# EAGLE design SunnyBuddy (EAGLE 6.6.0)
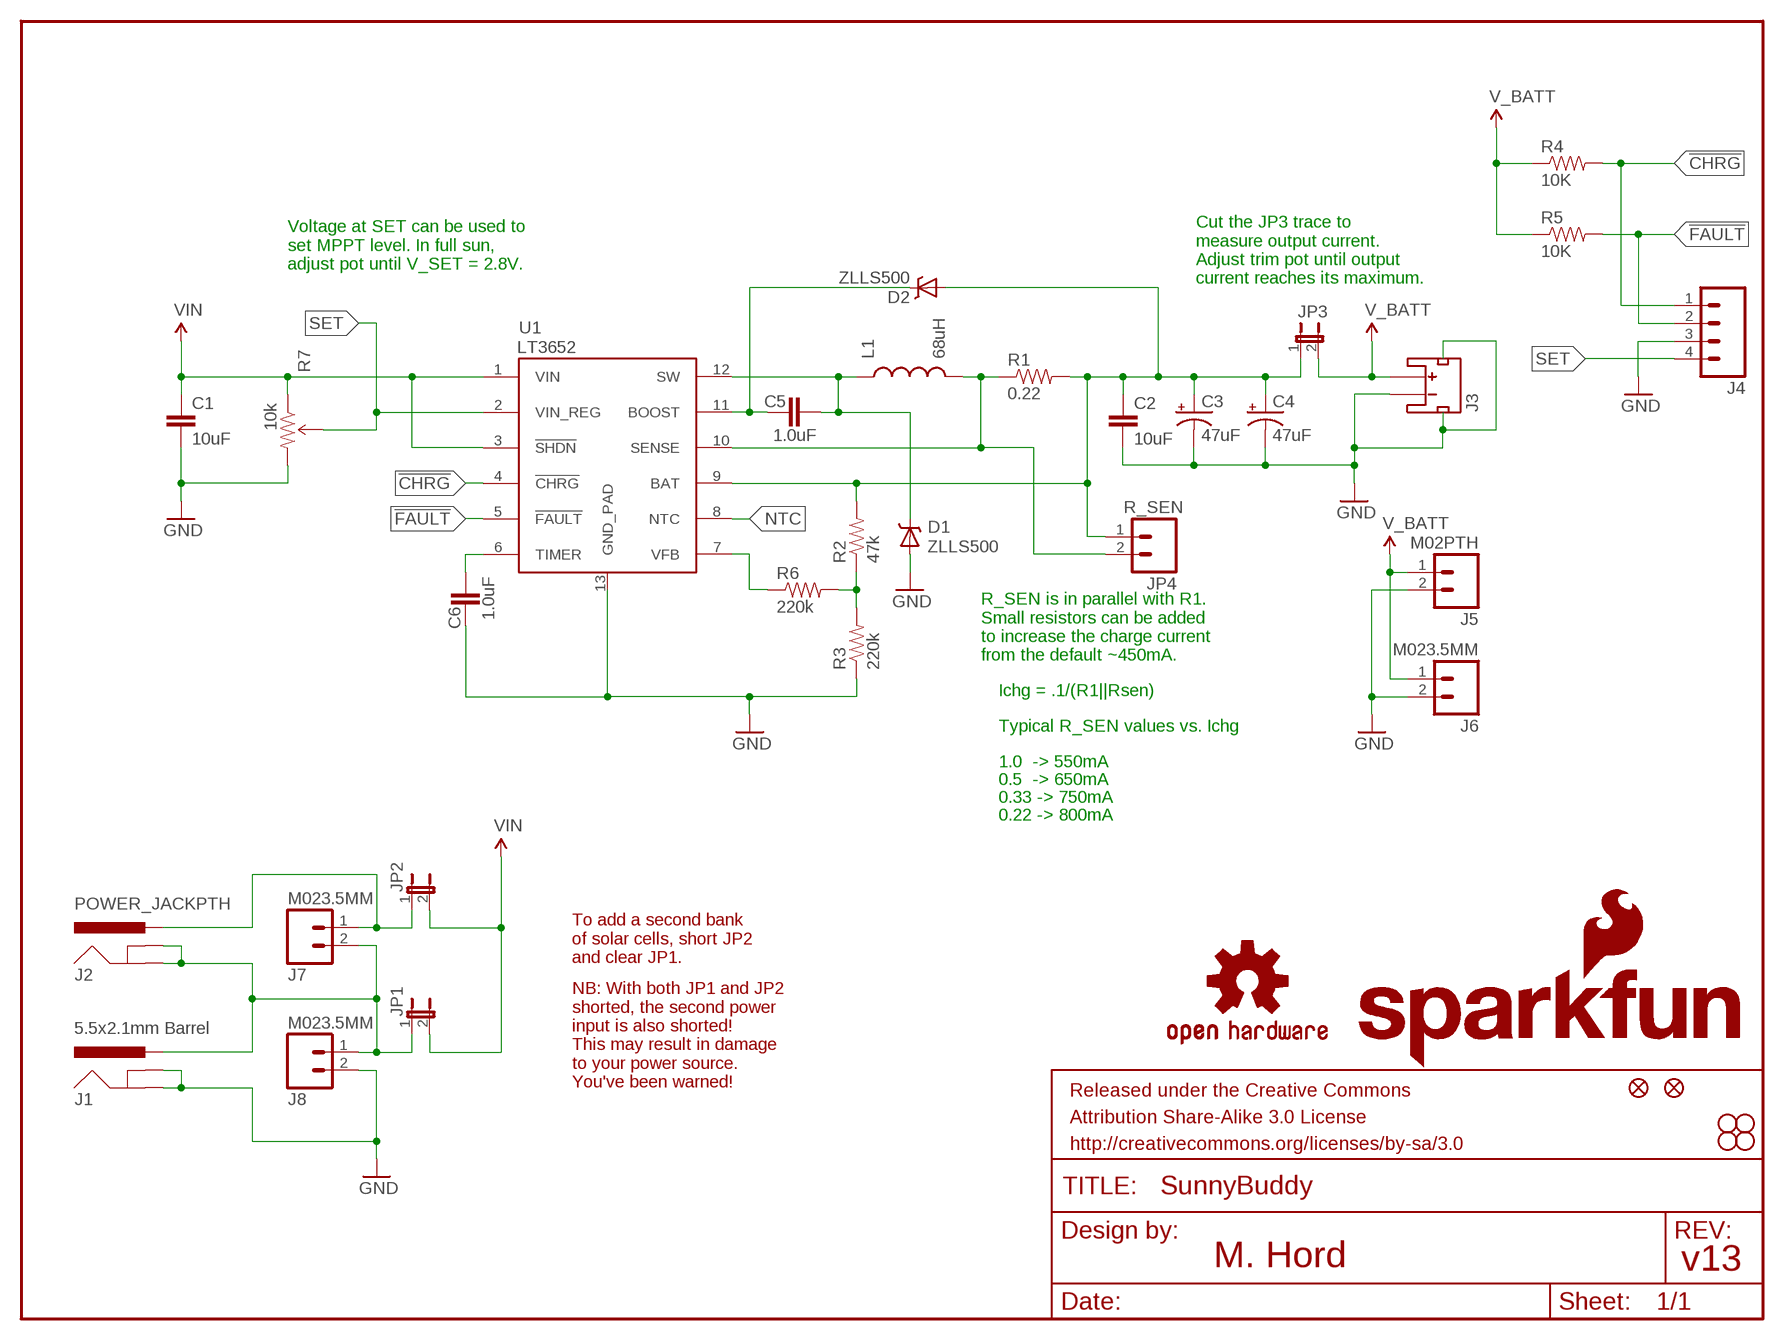
[diagram p0: schematic, sheet 1]

## Parts
C1  10uF  10UF50V20%(1210)  [1210]
C2  10uF  10UF-6.3V-20%(1206)  [1206]
C3  47uF  47UF-TANT  [EIA3528]
C4  47uF  47UF-TANT  [EIA3528]
C5  1.0uF  1.0UF-16V-10%(0603)  [0603-CAP]
C6  1.0uF  1.0UF-16V-10%(0603)  [0603-CAP]
D1  ZLLS500  ZLLS500ZLLS500  [SOT23]
D2  ZLLS500  ZLLS500ZLLS500  [SOT23]
FID1  FIDUCIAL1X2  [FIDUCIAL-1X2]
FID2  FIDUCIAL1X2  [FIDUCIAL-1X2]
FRAME1  FRAME-LETTER  [CREATIVE_COMMONS]
J1  5.5x2.1mm Barrel  POWER_JACKSMD  [POWER_JACK_SMD]
J2  POWER_JACKPTH  [POWER_JACK_PTH]
J3  JST_2MM_MALE  [JST-2-SMD]
J4  M04PTH  [1X04]
J5  M02PTH  [1X02]
J6  M023.5MM  [SCREWTERMINAL-3.5MM-2]
J7  M023.5MM  [SCREWTERMINAL-3.5MM-2]
J8  M023.5MM  [SCREWTERMINAL-3.5MM-2]
JP1  JUMPER-2SMD-NC  [SJ_2S]
JP2  JUMPER-2SMD-NO  [SJ_2S-NO]
JP3  JUMPER-PTH-2-NC  [PTH-JUMPER-NC_BOTTOM_NO_SILK]
JP4  R_SEN  M02PTH  [1X02]
L1  68uH  INDUCTOR68UH-1A  [CR75]
LOGO1  SFE_LOGO_NAME_FLAME.2_INCH  [SFE_LOGO_NAME_FLAME_.2]
LOGO2  OSHW-LOGOM  [OSHW-LOGO-M]
LOGO3  OSHW-LOGOS  [OSHW-LOGO-S]
LOGO4  SFE_LOGO_NAME_FLAME.3_INCH  [SFE_LOGO_NAME_FLAME_.3]
R1  0.22  0.22OHM1/4W1%(0805)  [0805]
R2  47k  47KOHM1/10W1%(0603)  [0603-RES]
R3  220k  220KOHM1/10W1%(0603)  [0603-RES]
R4  10K  10KOHM1/10W1%(0603)0603  [0603-RES]
R5  10K  10KOHM1/10W1%(0603)0603  [0603-RES]
R6  220k  220KOHM1/10W1%(0603)  [0603-RES]
R7  10k  TRIMPOTRES-09285  [TRIMPOT-3MM]
STANDOFF1  STAND-OFF  [STAND-OFF]
STANDOFF2  STAND-OFF  [STAND-OFF]
STANDOFF3  STAND-OFF  [STAND-OFF]
STANDOFF4  STAND-OFF  [STAND-OFF]
U1  LT3652  [MSOP-12_GND]

## Nets
!CHRG: J4.1 R4.2 U1.4(!CHRG)
!FAULT: J4.2 R5.2 U1.5(!FAULT)
BOOST: C5.1 D2.3(C) U1.11(BOOST)
FB: R2.1 R3.2 R6.2
GND: C1.2 C2.2 C3.C(-) C4.C(-) C6.1 D1.1(A) J1.GND(GNDBREAK) J1.P$4(GND) J3.1(-) J3.NC1(PAD1) J3.NC2(PAD2) J4.3 J5.2 J6.2 J8.2 R3.1 R7.3(CW) U1.13(GND_PAD)
N$3: R6.1 U1.7(VFB)
N$4: C2.1 C3.A(+) C4.A(+) D2.1(A) JP3.1 JP4.1 R1.2 R2.2 U1.9(BAT)
N$8: J1.VIN0(PWR) J2.GND J2.GNDBREAK J7.2 J8.1 JP1.1
NTC: U1.8(NTC)
SENSE: JP4.2 L1.P$2 R1.1 U1.10(SENSE)
SET: J4.4 R7.2(WIPER) U1.2(VIN_REG)
SFSASDF: J2.PWR J7.1 JP2.1
SW: C5.2 D1.3(C) L1.P$1 U1.12(SW)
TIMER: C6.2 U1.6(TIMER)
V_BATT: J3.2(+) J5.1 J6.1 JP3.2 R4.1 R5.1
VIN: C1.1 JP1.2 JP2.2 R7.1(CCW) U1.1(VIN) U1.3(!SHDN)

## Notes on the sheet
- Voltage at SET can be used to
  set MPPT level. In full sun,
  adjust pot until V_SET = 2.8V.
- Cut the JP3 trace to
  measure output current.
  Adjust trim pot until output
  current reaches its maximum.
- R_SEN is in parallel with R1.
  Small resistors can be added
  to increase the charge current
  from the default ~450mA.
- Ichg = .1/(R1||Rsen)
- Typical R_SEN values vs. Ichg
- 1.0  -> 550mA
- 0.5  -> 650mA
- 0.33 -> 750mA
- 0.22 -> 800mA
- To add a second bank
  of solar cells, short JP2
  and clear JP1.
- NB: With both JP1 and JP2
  shorted, the second power
  input is also shorted! 
  This may result in damage
  to your power source.
  You've been warned!
- M. Hord | v13

## Library data of the parts
C1 = SparkFun-Capacitors:10UF50V20%(1210): CAP-09824; PROD_ID: CAP-09824
C2 = SparkFun-Capacitors:10UF-6.3V-20%(1206): Ceramic CAP-10057; PROD_ID: CAP-10057
C3 C4 = SparkFun-Capacitors:47UF-TANT: 47uF Tantalum SMT CAP-08310- 10V 10% (EIA-3528); PROD_ID: CAP-08310
C5 C6 = SparkFun-Capacitors:1.0UF-16V-10%(0603): CAP-00868; PROD_ID: CAP-00868
D1 D2 = SparkFun-DiscreteSemi:ZLLS500: 700mA 40V SOT-23 Schottky; PROD_ID: DIO-08411
FID1 FID2 = SparkFun-Aesthetics:FIDUCIAL: Fiducial Alignment Points Various fiducial points for machine vision alignment.
FRAME1 = SparkFun-Aesthetics:FRAME-LETTER: Schematic Frame Standard 8.5x11 US Letter frame
J1 = SparkFun-Connectors:POWER_JACK: Power Jack This is the standard 5.5mm barrel jack for power. The PTH is the most common, proven, reliable, footprint. The Slot footprint only works if the mill layer is transmitted to the PCB fab house so be warned. Spark Fun Electronics SKU : PRT-00119 SMT: CONN-08106 Mating wall wart : TOL-00298 (and others); PROD_ID: CONN-08106
J2 = SparkFun-Connectors:POWER_JACK: Power Jack This is the standard 5.5mm barrel jack for power. The PTH is the most common, proven, reliable, footprint. The Slot footprint only works if the mill layer is transmitted to the PCB fab house so be warned. Spark Fun Electronics SKU : PRT-00119 SMT: CONN-08106 Mating wall wart : TOL-00298 (and others)
J3 = SparkFun-Connectors:JST_2MM_MALE: Mates to single-cell LiPo batteries. CONN-08352; PROD_ID: CONN-08352
J4 = SparkFun-Connectors:M04: Header 4 Standard 4-pin 0.1" header. Use with straight break away headers (SKU : PRT-00116), right angle break away headers (PRT-00553), swiss pins (PRT-00743), machine pins (PRT-00117), and female headers (PRT-00115). Molex polarized connector foot print use with SKU : PRT-08231 with associated crimp pins and housings. 1MM SMD Version SKU: PRT-10208
J5-J8 JP4 = SparkFun-Connectors:M02: Standard 2-pin 0.1" header. Use with - straight break away headers ( PRT-00116) - right angle break away headers (PRT-00553) - swiss pins (PRT-00743) - machine pins (PRT-00117) - female headers (PRT-00115) Molex polarized connector foot print use with: PRT-08233 with associated crimp pins and housings. 2.54_SCREWTERM for use with PRT-10571. 3.5mm Screw Terminal footprints for PRT-08084 5mm Screw Terminal footprints for use with PRT-08433
JP1 JP2 = SparkFun-Passives:JUMPER-2: Jumper Basic 0.1" spaced jumper. Use with breakaway headers.
JP3 = SparkFun-Passives:JUMPER-PTH-2-NC
L1 = SparkFun-Passives:INDUCTOR: Inductors Basic Inductor/Choke - 0603 and 1206. Footprints are not proven and vary greatly between part numbers. SRN6045- 33uH, 20% 1.4A SDR0403-560KL - 56uH, 10%, 500mA RMS/740mA peak; PROD_ID: NDUC-09739
LOGO1 LOGO4 = SparkFun-Aesthetics:SFE_LOGO_NAME_FLAME: SFE Logo, name and flame This is the SparkFun full logo. The logo on the schematic will always be the same size; the package variant is the height of the flame part of the logo. Default layer for the logo on the board is tSilk.
LOGO2 LOGO3 = SparkFun-Aesthetics:OSHW-LOGO: Open Source Hardware Logo This logo indicates the piece of hardware it is found on incorporates a OSHW license and/or adheres to the definition of open source hardware found here: http://freedomdefined.org/OSHW
R1 = SparkFun-Resistors:0.22OHM1/4W1%(0805): RES-09883; PROD_ID: RES-09883
R2 = SparkFun-Resistors:47KOHM1/10W1%(0603): RES-07871; PROD_ID: RES-07871; VALUE: 47K
R3 R6 = SparkFun-Resistors:220KOHM1/10W1%(0603): RES-08969; PROD_ID: RES-08969
R4 R5 = SparkFun-Resistors:10KOHM1/10W1%(0603): RES-00824; PROD_ID: RES-00824
R7 = SparkFun-Electromechanical:TRIMPOT: Various small potentiometers for "set-and-forget" applications; PROD_ID: RES-09285
STANDOFF1-STANDOFF4 = SparkFun-Electromechanical:STAND-OFF: #4 Stand Off This is the mechanical footprint for a #4 phillips button head screw. Use the keepout ring to avoid running the screw head into surrounding components. SKU : PRT-00447
U1 = SparkFun-PowerIC:LT3652: LT3652 MPPT Solar Charge Controller 5V-32V smart charger for batteries up to 14.4V

## Board
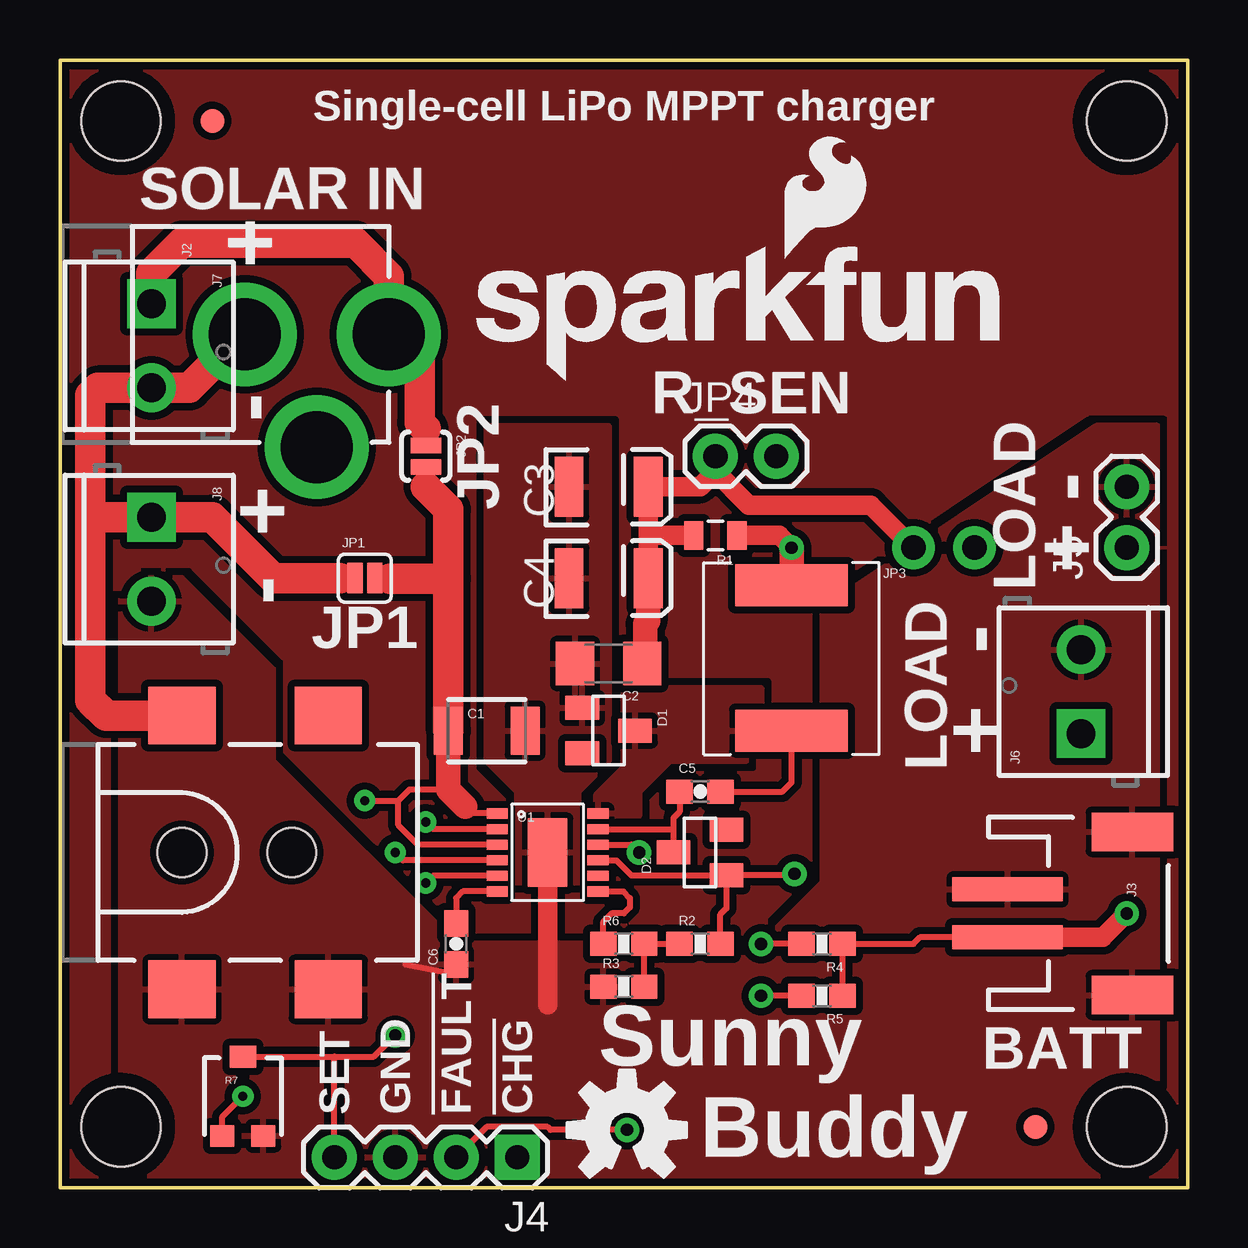
[diagram p1: board, top side]
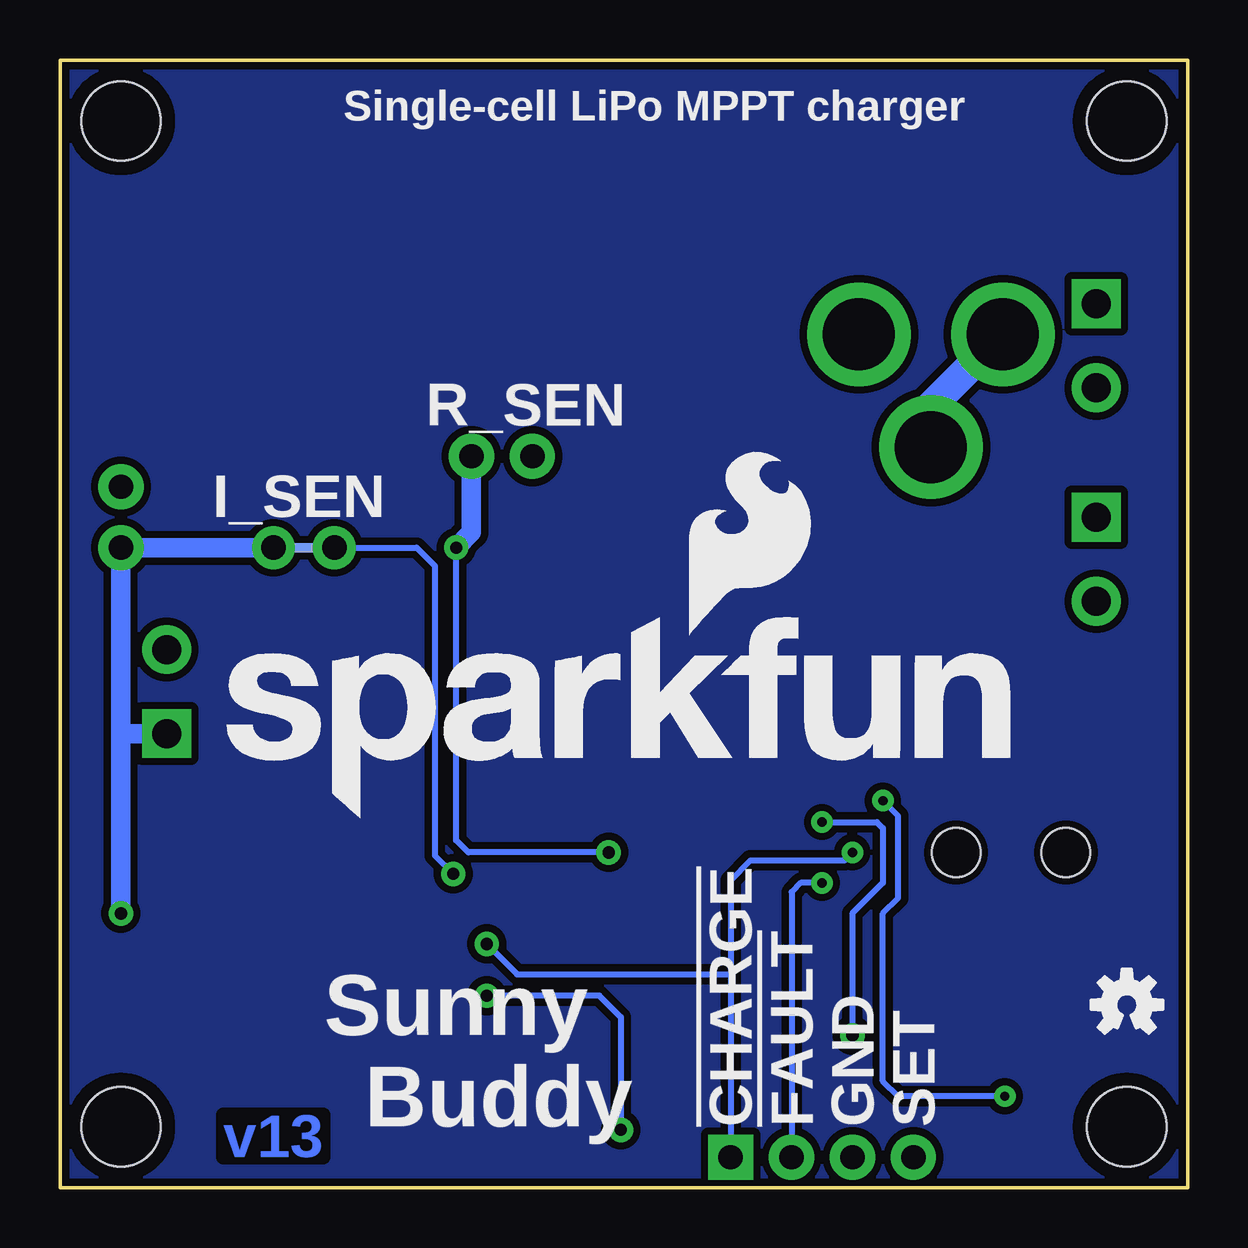
[diagram p2: board, bottom side, seen from below]

Size 46.99 x 46.99 mm. Coordinates in mm from the lower left corner, seen from the top.
Outline: 0,46.99 46.99,46.99 46.99,0 0,0 0,46.99
Copper layers (1*16): Top 0.035mm / dielectric 1.5mm / Bottom 0.035mm
Design rules "Sparkfun": minimum track width 8mil, minimum drill 20mil, track to track 8mil, track to pad 8mil, pad to pad 8mil, via to via 8mil, smd to smd 8mil, copper to edge 8mil, drill to drill 8mil, minimum pad ring 12mil, minimum via ring 10mil, stop-mask expansion 4mil, vias tented up to drill 20mil, thermal gap 10mil

### Footprints (pad centres in the part's own frame; a part is rotated, then mirrored left to right if it is on the bottom)
1210 = smd 1.2 x 2: 1 -1.6,0; 2 1.6,0
1206 = smd 1.6 x 1.8: 1 -1.4,0; 2 1.4,0
EIA3528 = smd 1.2 x 2.5: A 1.65,0; C -1.65,0
0603-CAP = smd 1.1 x 1: 1 -0.85,0; 2 0.85,0
SOT23 = smd 1 x 1.4: 1 -0.95,-1.1; 2 0.95,-1.1; 3 0,1.1
FIDUCIAL-1X2 = smd 1 x 1: 1 0,0
POWER_JACK_SMD = smd 2.8 x 2.4: GND 0,-5.7; P$4 6.1,-5.7; VIN0 0,5.7; VIN1 6.1,5.7 | hole 2.032: 0,0; 4.572,0
POWER_JACK_PTH = drill 2.997 pad 4.318: GND 0,7.7; GNDBREAK 4.7,10.7; PWR 0,13.7
JST-2-SMD = smd 1 x 4.6: 1 -1,-3.7; 2 1,-3.7 | smd 1.6 x 3.4: NC1 -3.4,1.5; NC2 3.4,1.5
1X04 = drill 1.016 pad 1.88 square: 1 0,0 | drill 1.016 pad 1.88: 2 2.54,0; 3 5.08,0; 4 7.62,0
1X02 = drill 1.016 pad 1.88: 1 0,0; 2 2.54,0
SCREWTERMINAL-3.5MM-2 = drill 1.2 pad 2.032 square: 1 0,0 | drill 1.2 pad 2.032: 2 3.5,0
SJ_2S = smd 0.635 x 1.27: 1 -0.412,0; 2 0.412,0
SJ_2S-NO = smd 0.635 x 1.27: 1 -0.45,0; 2 0.45,0
PTH-JUMPER-NC_BOTTOM_NO_SILK = drill 1.016 pad 1.778: 1 -1.27,0; 2 1.27,0 | smd 1.27 x 0.381 bottom: P$1 0,0
CR75 = smd 1.75 x 4.7: P$1 0,0; P$2 6.05,0
0805 = smd 0.8 x 1.2: 1 -0.9,0; 2 0.9,0
0603-RES = smd 1.1 x 1: 1 -0.85,0; 2 0.85,0
TRIMPOT-3MM = smd 1 x 0.9: 1 -0.85,-1.65; 3 0.85,-1.65 | smd 1.1 x 0.9: 2 0,1.65
STAND-OFF = hole 3.302: 0,0
MSOP-12_GND = smd 0.889 x 0.42: 1 -2.1,1.625; 2 -2.1,0.975; 3 -2.1,0.325; 4 -2.1,-0.325; 5 -2.1,-0.975; 6 -2.1,-1.625; 7 2.1,-1.625; 8 2.1,-0.975; 9 2.1,-0.325; 10 2.1,0.325; 11 2.1,0.975; 12 2.1,1.625 | smd 1.651 x 2.845: 13 0,0

### Placement (x,y rotation side)
C1  17.78,19.05 0 top
C2  22.86,21.84 180 top
C3  22.86,29.21 0 top
C4  22.86,25.4 0 top
C5  26.67,16.51 0 top
C6  16.51,10.16 90 top
D1  22.86,19.05 270 top
D2  26.67,13.97 90 top
FID1  6.35,44.45 0 top
FID2  40.64,2.54 0 top
FRAME1  46.99,-26.67 0 top  (outside the outline)
J1  5.08,13.97 0 top
J2  0,35.56 270 top
J3  43.18,11.43 270 top
J4  19.05,1.27 180 top
J5  44.45,26.67 90 top
J6  42.55,18.92 90 top
J7  3.81,36.83 270 top
J8  3.81,27.94 270 top
JP1  12.7,25.4 0 top
JP2  15.24,30.48 270 top
JP3  36.83,26.67 0 top
JP4  27.3,30.48 0 top
L1  30.48,19.05 90 top
LOGO1  16.64,33.53 0 top
LOGO2  23.62,2.41 0 top
LOGO3  2.54,7.62 0 bottom
LOGO4  40.64,15.24 0 bottom
R1  27.3,27.18 180 top
R2  26.67,10.16 0 top
R3  23.5,8.38 0 top
R4  31.75,10.16 180 top
R5  31.75,8 180 top
R6  23.5,10.16 0 top
R7  7.62,3.81 0 top
STANDOFF1  2.54,2.54 0 top
STANDOFF2  2.54,44.45 0 top
STANDOFF3  44.45,44.45 0 top
STANDOFF4  44.45,2.54 0 top
U1  20.32,13.97 0 top

### Tracks (layer width: path | path; a pad name or v marks a point on that pad's centre or on a via)
!CHRG  (via drill 0.38, 0.51)
  Top 0.254: R4.2 v29.21,10.16 | U1.4 14.29,13.64 v13.97,13.97
  Bottom 0.254: 19.05,8.89 19.05,12.81 U1.4 14.29,13.64 v13.97,13.97 | 19.05,8.89 J4.1 | 19.05,8.89 27.94,8.89 v29.21,10.16
!FAULT  (via drill 0.38, 0.51)
  Top 0.254: v23.62,2.41 20.45,2.41 20.32,2.54 17.78,2.54 J4.2 | R5.2 v29.21,8 | U1.5 15.54,12.99 v15.24,12.7
  Bottom 0.254: J4.2 16.51,12.32 16.13,12.7 v15.24,12.7 | v23.62,2.41 23.62,7.11 24.51,8 v29.21,8
BOOST
  Top 0.254: D2.3 25.57,14.86 | 25.57,14.86 25.57,15.41 25.82,15.66 C5.1 | U1.11 25.48,14.95 25.57,14.86
FB
  Top 0.254: R2.1 R6.2 R3.2
GND
  Top 0.254: 14.39,9.31 16.51,8.89
  Top 0.813: U1.13 20.32,7.62
  pour Top (isolate 0.305): 43.18,31.75 31.75,24.13 31.75,12.7 29.21,10.16 16.51,10.16 8.89,17.78 8.89,21.59 5.08,25.4 2.54,25.4 2.54,0 45.72,0 45.72,31.75
  pour Top (isolate 0.305): 22.86,31.75 22.86,17.78 21.59,16.51 21.59,12.7 19.05,12.7 19.05,16.51 17.78,17.78 17.78,31.75
N$1
  pour Top (isolate 0.305, rank 2, no thermals): 0,46.99 46.99,46.99 46.99,0 0,0
N$2
  pour Bottom (isolate 0.305, rank 2, no thermals): 0,46.99 46.99,46.99 46.99,0 0,0
N$3
  Top 0.254: U1.7 23.47,12.35 23.75,12.06 23.75,11.68 23.5,11.43 22.99,11.43 22.64,11.09 R6.1
N$4  (via drill 0.51)
  Top 0.254: U1.9 23.18,13.64 23.81,13.02 D2.1 | 24.13,21.97 C2.1 | D2.1 27.77,11.64 27.52,11.39 R2.2 | v30.61,13.08 30.55,13.02 D2.1
  Top 0.813: C4.A 24.51,27.18 | 24.51,27.18 C3.A 26.67,29.21 27.3,29.84 | 27.3,29.84 JP4.1 | R1.2 24.51,27.18 | JP3.1 33.78,28.45 28.7,28.45 27.3,29.84
  Top 1.016: C4.A 24.51,23.62 24.38,23.5 24.38,21.97 C2.1
  Bottom 0.254: JP3.1 32.13,26.67 31.37,25.91 31.37,13.84 v30.61,13.08
N$8
  Top 0.254: J2.GND 7.62,35.56 | 11.68,25.4 JP1.1
  Top 1.27: 7.62,35.56 5.39,33.33 J7.2 1.58,33.33 1.27,33.02 1.27,27.94 | 1.27,27.94 1.27,20.32 1.92,19.67 J1.VIN0 | 11.68,25.4 8.89,25.4 6.35,27.94 J8.1 1.27,27.94
  Bottom 1.27: J2.GNDBREAK 10.7,32.56 J2.GND
SENSE  (via drill 0.51)
  Top 0.254: U1.10 23.8,14.29 v24.13,13.97
  Top 0.813: R1.1 29.97,27.18 v30.48,26.67
  Top 1.016: v30.48,26.67 L1.P$2
  Bottom 0.254: v24.13,13.97 29.97,13.97 30.48,14.48 v30.48,26.67
  Bottom 0.813: JP4.2 29.84,27.3 v30.48,26.67
SET  (via drill 0.38, 0.51)
  Top 0.254: R7.2 11.43,5.46 | 11.43,5.46 13.08,5.46 v13.97,6.35 | U1.2 15.54,14.95 v15.24,15.24 | J4.4 11.43,5.46
  Bottom 0.254: v15.24,15.24 12.95,15.24 12.7,14.99 12.7,12.7 13.97,11.43 v13.97,6.35
SFSASDF
  Top 0.254: JP2.1 15.24,31.62
  Top 1.27: J7.1 3.81,38.1 5.08,39.37 12.32,39.37 13.7,37.99 J2.PWR 14.99,34.42 14.99,31.88 15.24,31.62
SW
  Top 0.254: C5.2 30.1,16.51 30.48,16.89 L1.P$1
  pour Top (isolate 0.305): 23.5,20.83 29.21,20.83 29.21,18.41 28.57,17.78 25.4,17.78 24.13,16.51 24.13,15.49 22.35,15.49 22.35,16.38 23.5,17.53
TIMER
  Top 0.254: U1.6 16.79,12.35 16.51,12.06 C6.2
V_BATT  (via drill 0.51)
  Top 0.254: R5.1 R4.1 35.56,10.16 35.83,10.43 J3.2
  Top 0.813: J3.2 43.45,10.43 v44.45,11.43
  Bottom 0.813: v44.45,11.43 44.45,19.05 | 44.45,19.05 J5.1 JP3.2 | J6.1 44.32,18.92 44.45,19.05
VIN  (via drill 0.38)
  Top 0.254: 13.73,25.39 13.72,25.4 JP1.2 | JP2.2 15.24,29.21 | U1.1 17.17,15.6 16.89,15.88 | U1.3 14.91,14.29 14.1,15.11 14.1,16.13 | 14.1,16.13 14.55,16.59 16.18,16.59 | R7.1 6.77,2.96 v7.62,3.81 | v12.7,16.13 14.1,16.13
  Top 1.016: C1.1 16.18,16.59 16.89,15.88
  Top 1.27: C1.1 16.18,25.39 | 16.18,25.39 13.73,25.39 | 16.18,25.39 16.18,28.27 15.24,29.21
  Bottom 0.254: v7.62,3.81 12.06,3.81 12.7,4.45 12.7,11.43 12.06,12.06 12.06,15.49 v12.7,16.13

### Text on the board
Bottom: v13
tPlace: Single-cell LiPo MPPT charger | SOLAR IN | + | - | R_SEN | JP2 | - | + | + | - | LOAD | - | JP1 | + | LOAD | BATT | Sunny | SET | GND | !FAULT | !CHG | Buddy
bPlace: Single-cell LiPo MPPT charger | R_SEN | I_SEN | Sunny | SET | GND | !FAULT | !CHARGE | Buddy
tDocu: M. Hord